# EasyEDA schematic ECE411.json
TITLE: Arduino Micro Clone; REV: 1.0; Date: 2019-11-08; Sheet: 1/1; Drawn By: mchalona; Company: ECE411
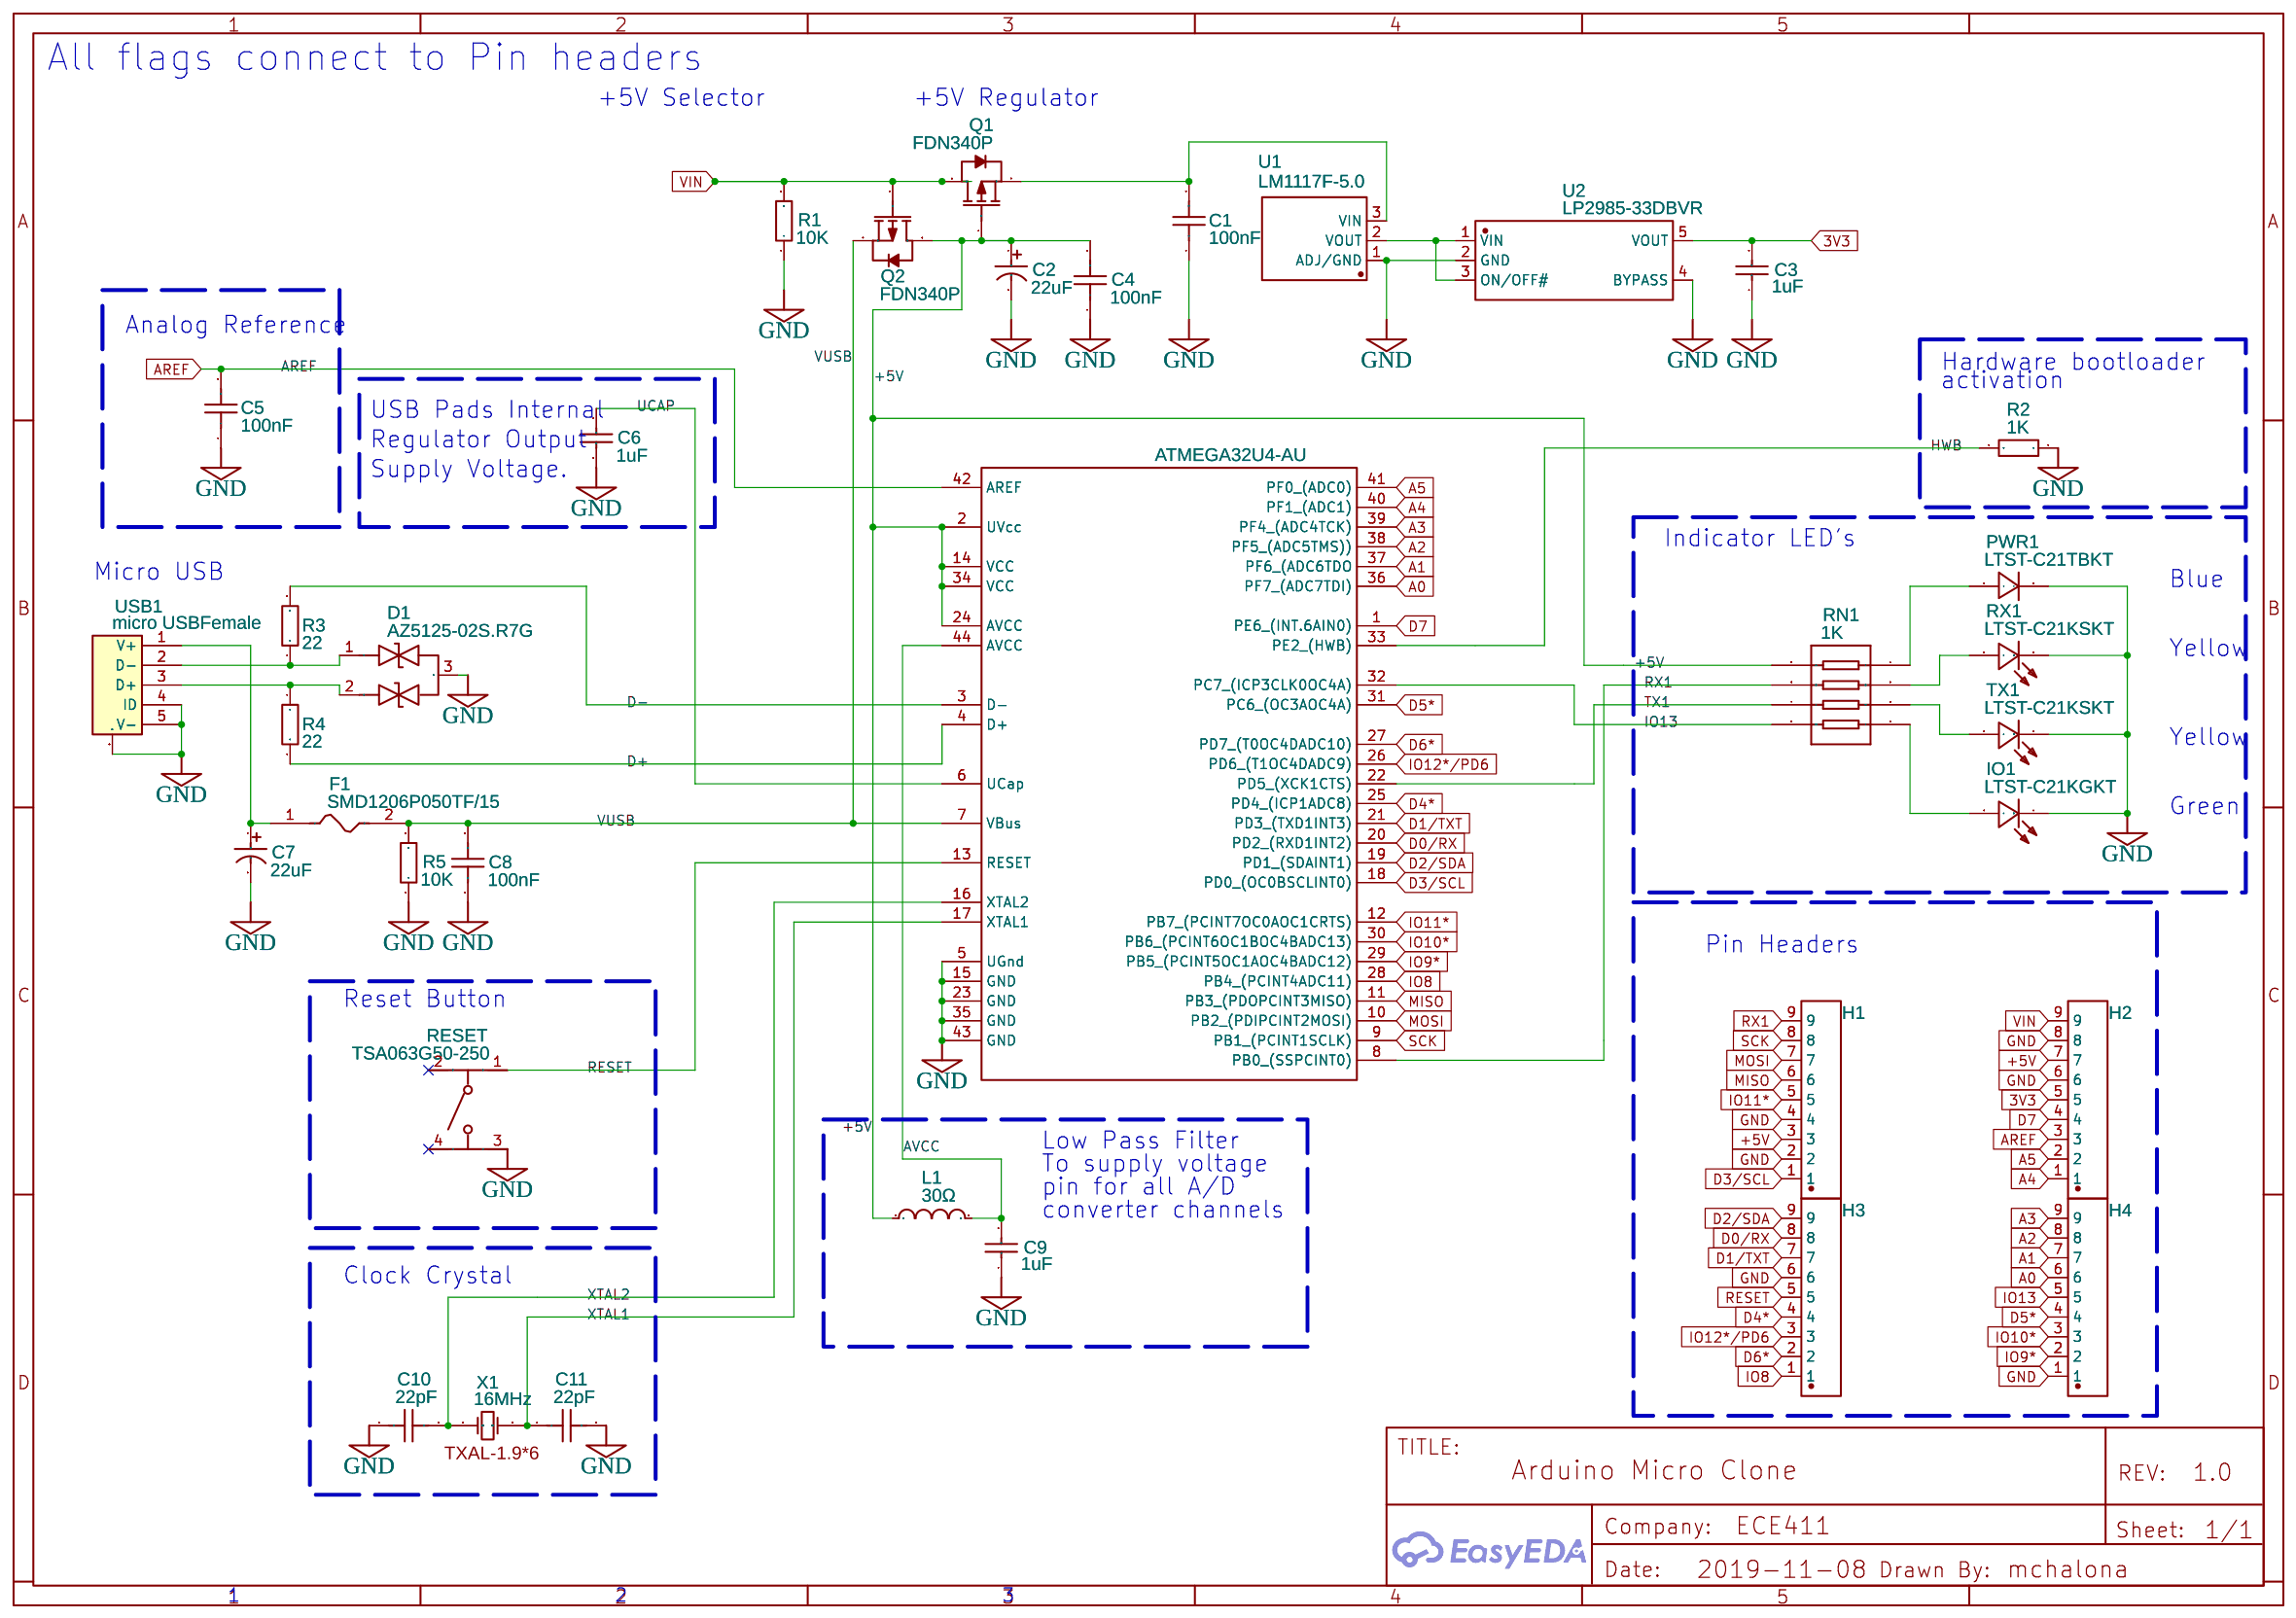
[diagram p0: schematic sheet]

## Parts
ATMEGA1U4-AU  ATMEGA32U4-AU  [QFP-44_10X10X08P]
C1  100nF  [0603]
C2  22uF  [CAP-SMD_BD5.0-L5.3-W5.3-FD]
C3  1uF  [0603]
C4  100nF  [0603]
C5  100nF  [0603]
C6  1uF  [0603]
C7  22uF  [CAP-SMD_BD5.0-L5.3-W5.3-FD]
C8  100nF  [0603]
C9  1uF  [0603]
C10  22pF  [0805]
C11  22pF  [0805]
D1  AZ5125-02S.R7G  [SOT-23-3_L2.9-W1.6-P1.90-LS2.8-BR]
F1  SMD1206P050TF/15  [FUSE-1206]
H1  A2541WV-9P  [SIP-2.54MM-9P-CJT-H8.54]
H2  A2541WV-9P  [SIP-2.54MM-9P-CJT-H8.54]
H3  A2541WV-9P  [SIP-2.54MM-9P-CJT-H8.54]
H4  A2541WV-9P  [SIP-2.54MM-9P-CJT-H8.54]
IO1  LTST-C21KGKT  [LED-SMD-3.2X1.6X1.1]
L1  30Ω  [0805]
PWR1  LTST-C21TBKT  [LED-SMD-3.2X1.6X1.1]
Q1  FDN340P  [SOT-23-3_L2.9-W1.6-P1.90-LS2.8-BR]
Q2  FDN340P  [SOT-23-3_L2.9-W1.6-P1.90-LS2.8-BR]
R1  10K  [0805]
R2  1K  [0805]
R3  22  [0805]
R4  22  [0805]
R5  10K  [0805]
RESET  TSA063G50-250  [SW-SMD-T6X6-9.5X5.8]
RN1  1K  [1206_X4]
RX1  LTST-C21KSKT  [LED-SMD-3.2X1.6X1.1]
TX1  LTST-C21KSKT  [LED-SMD-3.2X1.6X1.1]
U1  LM1117F-5.0  [SOT-89(SOT-89-3)]
U2  LP2985-33DBVR  [SOT-23-5]
USB1  micro USBFemale  [MICRO-USB-1]
X1  16MHz  [TXAL-1.9*6]

## Library data of the parts
ATMEGA1U4-AU = -: Supplier: LCSC; Manufacturer: MICROCHIP; image: //image.lceda.cn/szlcsc/C44854.jpg; Supplier Part: C44854; LCSC Assembly: Yes; SMT Type: Extend
C1 C4 C5 C8 = 0603B104J500NT: Supplier: LCSC; Manufacturer: FH; Supplier Part: C88136
C2 C7 = RVT1V220M0505-C23289: Supplier: LCSC; Manufacturer: HONOR; Manufacturer Part: RVT1V220M0505; Supplier Part: C23289
C3 C6 C9 = CL10A105KP8NNNC: Supplier: LCSC; Manufacturer: SAMSUNG; Supplier Part: C26413
C10 C11 = 0805CG220J500NT: Supplier: LCSC; Manufacturer: FH; Supplier Part: C24658
D1 = -: Supplier: LCSC; Supplier Part: C356820; Manufacturer: AMAZING; Contributor: LCSC
F1 = -: Supplier: LCSC; Manufacturer: PTTC; Supplier Part: C106264
H1-H4 = -: Supplier: LCSC; Supplier Part: C225484; Manufacturer: Changjiang Connectors; Contributor: LCSC
IO1 = -: Supplier: LCSC; Supplier Part: C284938; Manufacturer: Lite-On; Contributor: LCSC
L1 = MLB2012-300P3A(f): Supplier: LCSC; Manufacturer: ReliaPro; Supplier Part: C50503
PWR1 = -: Supplier: LCSC; Supplier Part: C284941; Manufacturer: Lite-On; Contributor: LCSC
Q1 Q2 = -: Supplier: LCSC; Manufacturer: FAIRCHILD; Supplier Part: C75469; LCSC Assembly: Yes; SMT Type: Extend
R1 R5 = RC0805FR-0710KL: Supplier: LCSC; Manufacturer: YAGEO; Supplier Part: C84376
R2 = 0805W8F1001T5E: Supplier: LCSC; Manufacturer: UniOhm; LCSC Assembly: Yes; Supplier Part: C17513; SMT Type: Basic
R3 R4 = 0805W8J0220T5E: Supplier: LCSC; Manufacturer: UniOhm; Supplier Part: C25295
RESET = -: Supplier: LCSC; Supplier Part: C294565; Manufacturer: BRIGHT; Contributor: LCSC
RN1 = CRA064RJ1KE04: Supplier: LCSC; Manufacturer: EVER OHMS; Contributor: LCSC; Supplier Part: C149873
RX1 TX1 = -: Supplier: LCSC; Supplier Part: C284940; Manufacturer: Lite-On; Contributor: LCSC
U1 = -: Supplier: LCSC; Manufacturer: HTC; Contributor: LCSC; Supplier Part: C126020; LCSC Assembly: Yes; SMT Type: Extend
U2 = -: Supplier: LCSC; Manufacturer: TI; Supplier Part: C95414; LCSC Assembly: Yes; SMT Type: Extend
USB1 = -: Supplier: LCSC; Manufacturer: ValuePro; image: //image.lceda.cn/szlcsc/C10418.jpg; Supplier Part: C10418
X1 = X206016MSD2SC: Supplier: LCSC; Manufacturer: YXC; Supplier Part: C2174; Package Display: Yes

## Nets
3V3: C3.2 H2.5 U2.5(VOUT)
+5V: ATMEGA1U4-AU.2(UVcc) ATMEGA1U4-AU.14(VCC) ATMEGA1U4-AU.24(AVCC) ATMEGA1U4-AU.34(VCC) C2.1 C4.2 H1.3 H2.7 L1.1 Q1.1(G) Q2.3(D) RN1.5
AVCC: ATMEGA1U4-AU.44(AVCC) C9.2 L1.2
GND: ATMEGA1U4-AU.5(UGnd) ATMEGA1U4-AU.15(GND) ATMEGA1U4-AU.23(GND) ATMEGA1U4-AU.35(GND) ATMEGA1U4-AU.43(GND) C1.1 C2.2 C3.1 C4.1 C5.1 C6.1 C7.2 C8.1 C9.1 C10.1 C11.2 D1.3 H1.2 H1.4 H2.6 H2.8 H3.6 H4.1 IO1.1(C) PWR1.2(-) R1.1 R2.1 R5.1 RESET.3 RX1.1(C) TX1.1(C) U1.1(ADJ/GND) U2.2(GND) U2.4(BYPASS) USB1.0(MTN) USB1.4(ID) USB1.5(V-)
VIN: H2.9 Q1.3(D) Q2.1(G) R1.2
A0: ATMEGA1U4-AU.36(PF7 (ADC7TDI)) H4.6
A1: ATMEGA1U4-AU.37(PF6 (ADC6TDO) H4.7
A2: ATMEGA1U4-AU.38(PF5 (ADC5TMS))) H4.8
A3: ATMEGA1U4-AU.39(PF4 (ADC4TCK)) H4.9
A4: ATMEGA1U4-AU.40(PF1 (ADC1)) H2.1
A5: ATMEGA1U4-AU.41(PF0 (ADC0)) H2.2
AREF: ATMEGA1U4-AU.42(AREF) C5.2 H2.3
D0/RX: ATMEGA1U4-AU.20(PD2 (RXD1INT2)) H3.8
D1/TXT: ATMEGA1U4-AU.21(PD3 (TXD1INT3)) H3.7
D2/SDA: ATMEGA1U4-AU.19(PD1 (SDAINT1)) H3.9
D3/SCL: ATMEGA1U4-AU.18(PD0 (OC0BSCLINT0)) H1.1
D4*: ATMEGA1U4-AU.25(PD4 (ICP1ADC8)) H3.4
D5*: ATMEGA1U4-AU.31(PC6 (OC3AOC4A)) H4.4
D6*: ATMEGA1U4-AU.27(PD7 (T0OC4DADC10)) H3.2
D7: ATMEGA1U4-AU.1(PE6 (INT.6AIN0)) H2.4
D+: ATMEGA1U4-AU.4(D+) R4.2
D-: ATMEGA1U4-AU.3(D-) R3.2
HWB: ATMEGA1U4-AU.33(PE2 (HWB)) R2.2
IO8: ATMEGA1U4-AU.28(PB4 (PCINT4ADC11)) H3.1
IO9*: ATMEGA1U4-AU.29(PB5 (PCINT5OC1AOC4BADC12)) H4.2
IO10*: ATMEGA1U4-AU.30(PB6 (PCINT6OC1BOC4BADC13)) H4.3
IO11*: ATMEGA1U4-AU.12(PB7 (PCINT7OC0AOC1CRTS)) H1.5
IO12*/PD6: ATMEGA1U4-AU.26(PD6 (T1OC4DADC9)) H3.3
IO13: ATMEGA1U4-AU.32(PC7 (ICP3CLK0OC4A)) H4.5 RN1.8
MISO: ATMEGA1U4-AU.11(PB3 (PDOPCINT3MISO)) H1.6
MOSI: ATMEGA1U4-AU.10(PB2 (PDIPCINT2MOSI)) H1.7
RESET: ATMEGA1U4-AU.13(RESET) H3.5 RESET.1
RX1: ATMEGA1U4-AU.8(PB0 (SSPCINT0)) H1.9 RN1.6
SCK: ATMEGA1U4-AU.9(PB1 (PCINT1SCLK)) H1.8
TX1: ATMEGA1U4-AU.22(PD5 (XCK1CTS)) RN1.7
UCAP: ATMEGA1U4-AU.6(UCap) C6.2
VUSB: ATMEGA1U4-AU.7(VBus) C8.2 F1.2 Q2.2(S) R5.2
XTAL1: ATMEGA1U4-AU.17(XTAL1) C11.1 X1.2(OSC2)
XTAL2: ATMEGA1U4-AU.16(XTAL2) C10.2 X1.1(OSC1)
Net-(C1-2): C1.2 Q1.2(S) U1.3(VIN)
Net-(C7-1): C7.1 F1.1 USB1.1(V+)
Net-(D1-1): D1.1 R3.1 USB1.2(D-)
Net-(D1-2): D1.2 R4.1 USB1.3(D+)
Net-(IO1-2): IO1.2(A) RN1.1
Net-(PWR1-1): PWR1.1(+) RN1.4
Net-(RN1-2): RN1.2 TX1.2(A)
Net-(RN1-3): RN1.3 RX1.2(A)
Net-(U1-2): U1.2(VOUT) U2.1(VIN) U2.3(ON/OFF#)

Not connected (* = marked no-connect by the designer): RESET 2* 4*

## Notes on the sheet
- All flags connect to Pin headers
- +5V Selector
- +5V Regulator
- Analog Reference
- activation
- Hardware bootloader
- USB Pads Internal
- Regulator Output
- Supply Voltage.
- Indicator LED's
- Micro USB
- Blue
- Yellow
- Yellow
- Green
- Pin Headers
- Reset Button
- Low Pass Filter
- To supply voltage
- pin for all A/D
- converter channels
- Clock Crystal
- 1
- 2
- 3
